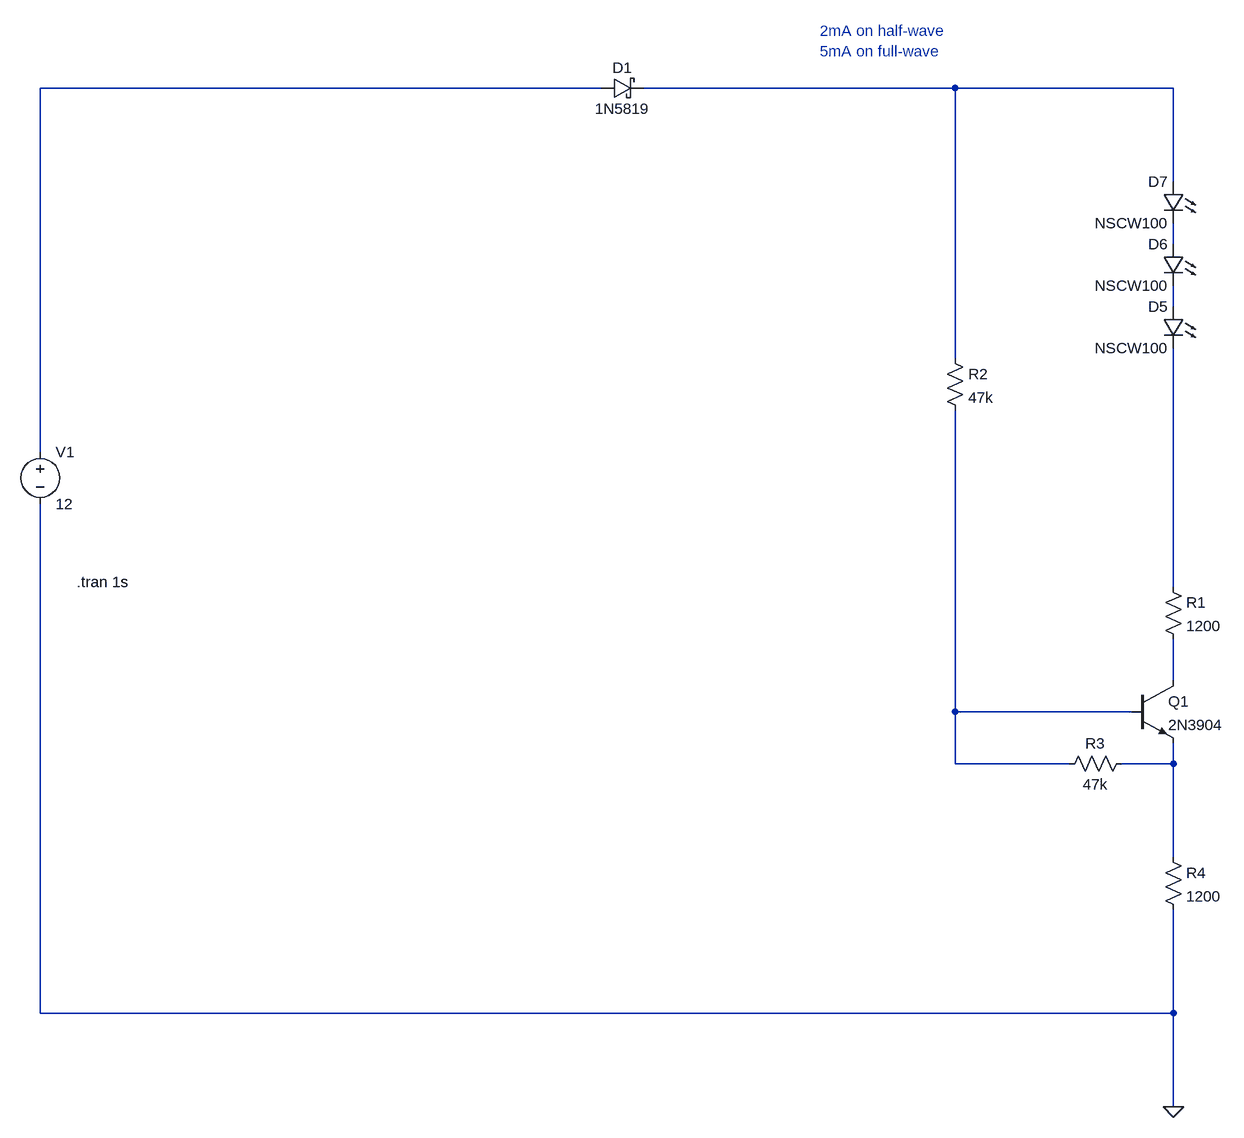
[diagram p0: schematic Wired_AND.asc]
Wired_AND.asc, the LTspice schematic file:
Version 4
SHEET 1 1576 980
WIRE 320 -608 -544 -608
WIRE 864 -608 384 -608
WIRE 1200 -608 864 -608
WIRE 1200 -464 1200 -608
WIRE 1200 -368 1200 -400
WIRE 1200 -272 1200 -304
WIRE 864 -192 864 -608
WIRE -544 -48 -544 -608
WIRE 1200 160 1200 -208
WIRE 1200 304 1200 240
WIRE 864 352 864 -112
WIRE 1136 352 864 352
WIRE 864 432 864 352
WIRE 1040 432 864 432
WIRE 1200 432 1200 400
WIRE 1200 432 1120 432
WIRE 1200 576 1200 432
WIRE -544 816 -544 32
WIRE 1200 816 1200 656
WIRE 1200 816 -544 816
WIRE 1200 960 1200 816
FLAG 1200 960 0
SYMBOL voltage -544 -64 R0
WINDOW 123 0 0 Left 0
WINDOW 39 0 0 Left 0
SYMATTR InstName V1
SYMATTR Value 12
SYMBOL schottky 320 -592 R270
WINDOW 0 32 32 VTop 2
WINDOW 3 0 32 VBottom 2
SYMATTR InstName D1
SYMATTR Value 1N5819
SYMATTR Description Diode
SYMATTR Type diode
SYMBOL LED 1216 -272 M0
SYMATTR InstName D5
SYMATTR Value NSCW100
SYMATTR Description Diode
SYMATTR Type diode
SYMBOL LED 1216 -368 M0
SYMATTR InstName D6
SYMATTR Value NSCW100
SYMATTR Description Diode
SYMATTR Type diode
SYMBOL LED 1216 -464 M0
SYMATTR InstName D7
SYMATTR Value NSCW100
SYMATTR Description Diode
SYMATTR Type diode
SYMBOL npn 1136 304 R0
SYMATTR InstName Q1
SYMATTR Value 2N3904
SYMBOL res 1184 144 R0
SYMATTR InstName R1
SYMATTR Value 1200
SYMBOL res 848 -208 R0
SYMATTR InstName R2
SYMATTR Value 47k
SYMBOL res 1136 416 R90
WINDOW 0 0 56 VBottom 2
WINDOW 3 32 56 VTop 2
SYMATTR InstName R3
SYMATTR Value 47k
SYMBOL res 1184 560 R0
SYMATTR InstName R4
SYMATTR Value 1200
TEXT -488 152 Left 2 !.tran 1s
TEXT 656 -696 Left 2 ;2mA on half-wave\n5mA on full-wave

The netlist it stands for:
* Wired_AND.asc
V1 N001 0 12
D1 N001 N002 1N5819
D5 N004 N005 NSCW100
D6 N003 N004 NSCW100
D7 N002 N003 NSCW100
Q1 N006 N007 N008 0 2N3904
R1 N005 N006 1200
R2 N002 N007 47k
R3 N008 N007 47k
R4 N008 0 1200
.model D D
.lib standard.dio
.model NPN NPN
.model PNP PNP
.lib standard.bjt
.tran 1s
* 2mA on half-wave
* 5mA on full-wave
.backanno
.end